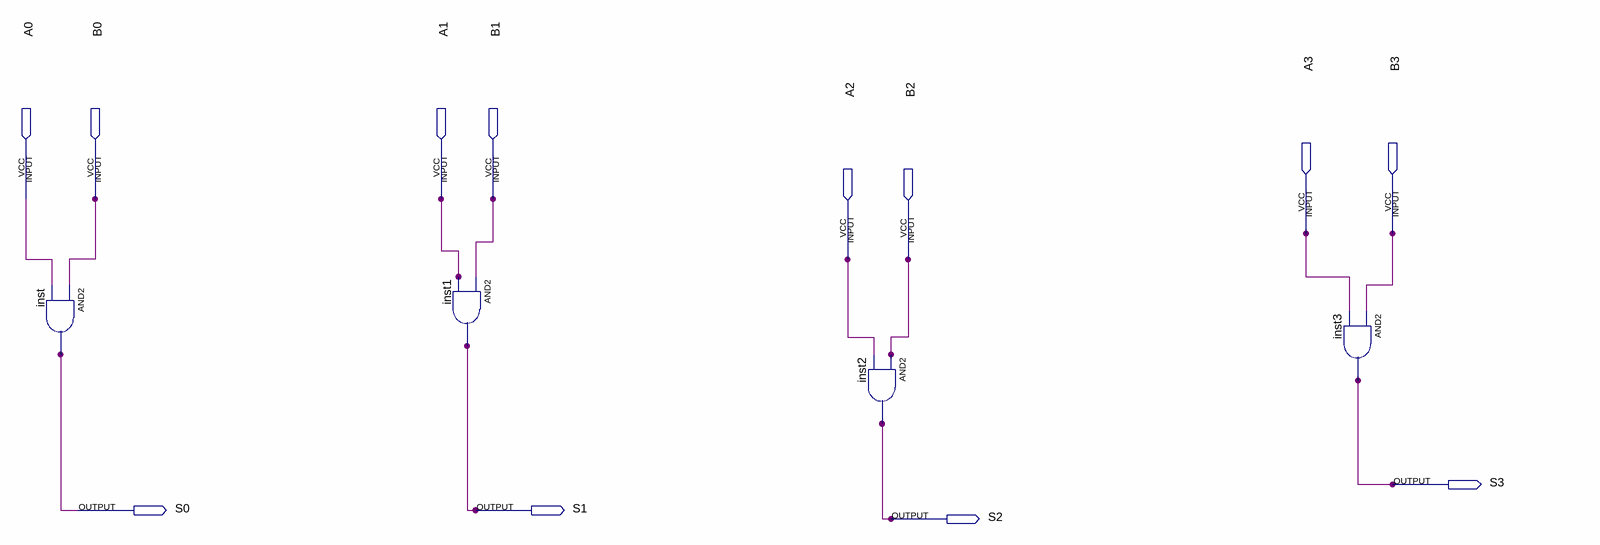
[diagram p0: schematic sheet]
// Quartus schematic ALUAND.bdf as structural Verilog: 4 symbols, 12 pins
module ALUAND (
  input  A0,
  input  B0,
  input  A1,
  input  B1,
  input  A3,
  input  B3,
  input  A2,
  input  B2,
  output S3,
  output S0,
  output S1,
  output S2
);

  and inst (S0, B0, A0);
  and inst1 (S1, B1, A1);
  and inst2 (S2, B2, A2);
  and inst3 (S3, B3, A3);
endmodule
